# Altium schematic sheet ltk-mw-tx-rx.SchDoc: MW Bench - combined
size A3; Author: Davide Bortolami; DocumentNumber: 1; Revision: 3.0; SheetNumber: 1; SheetTotal: 3
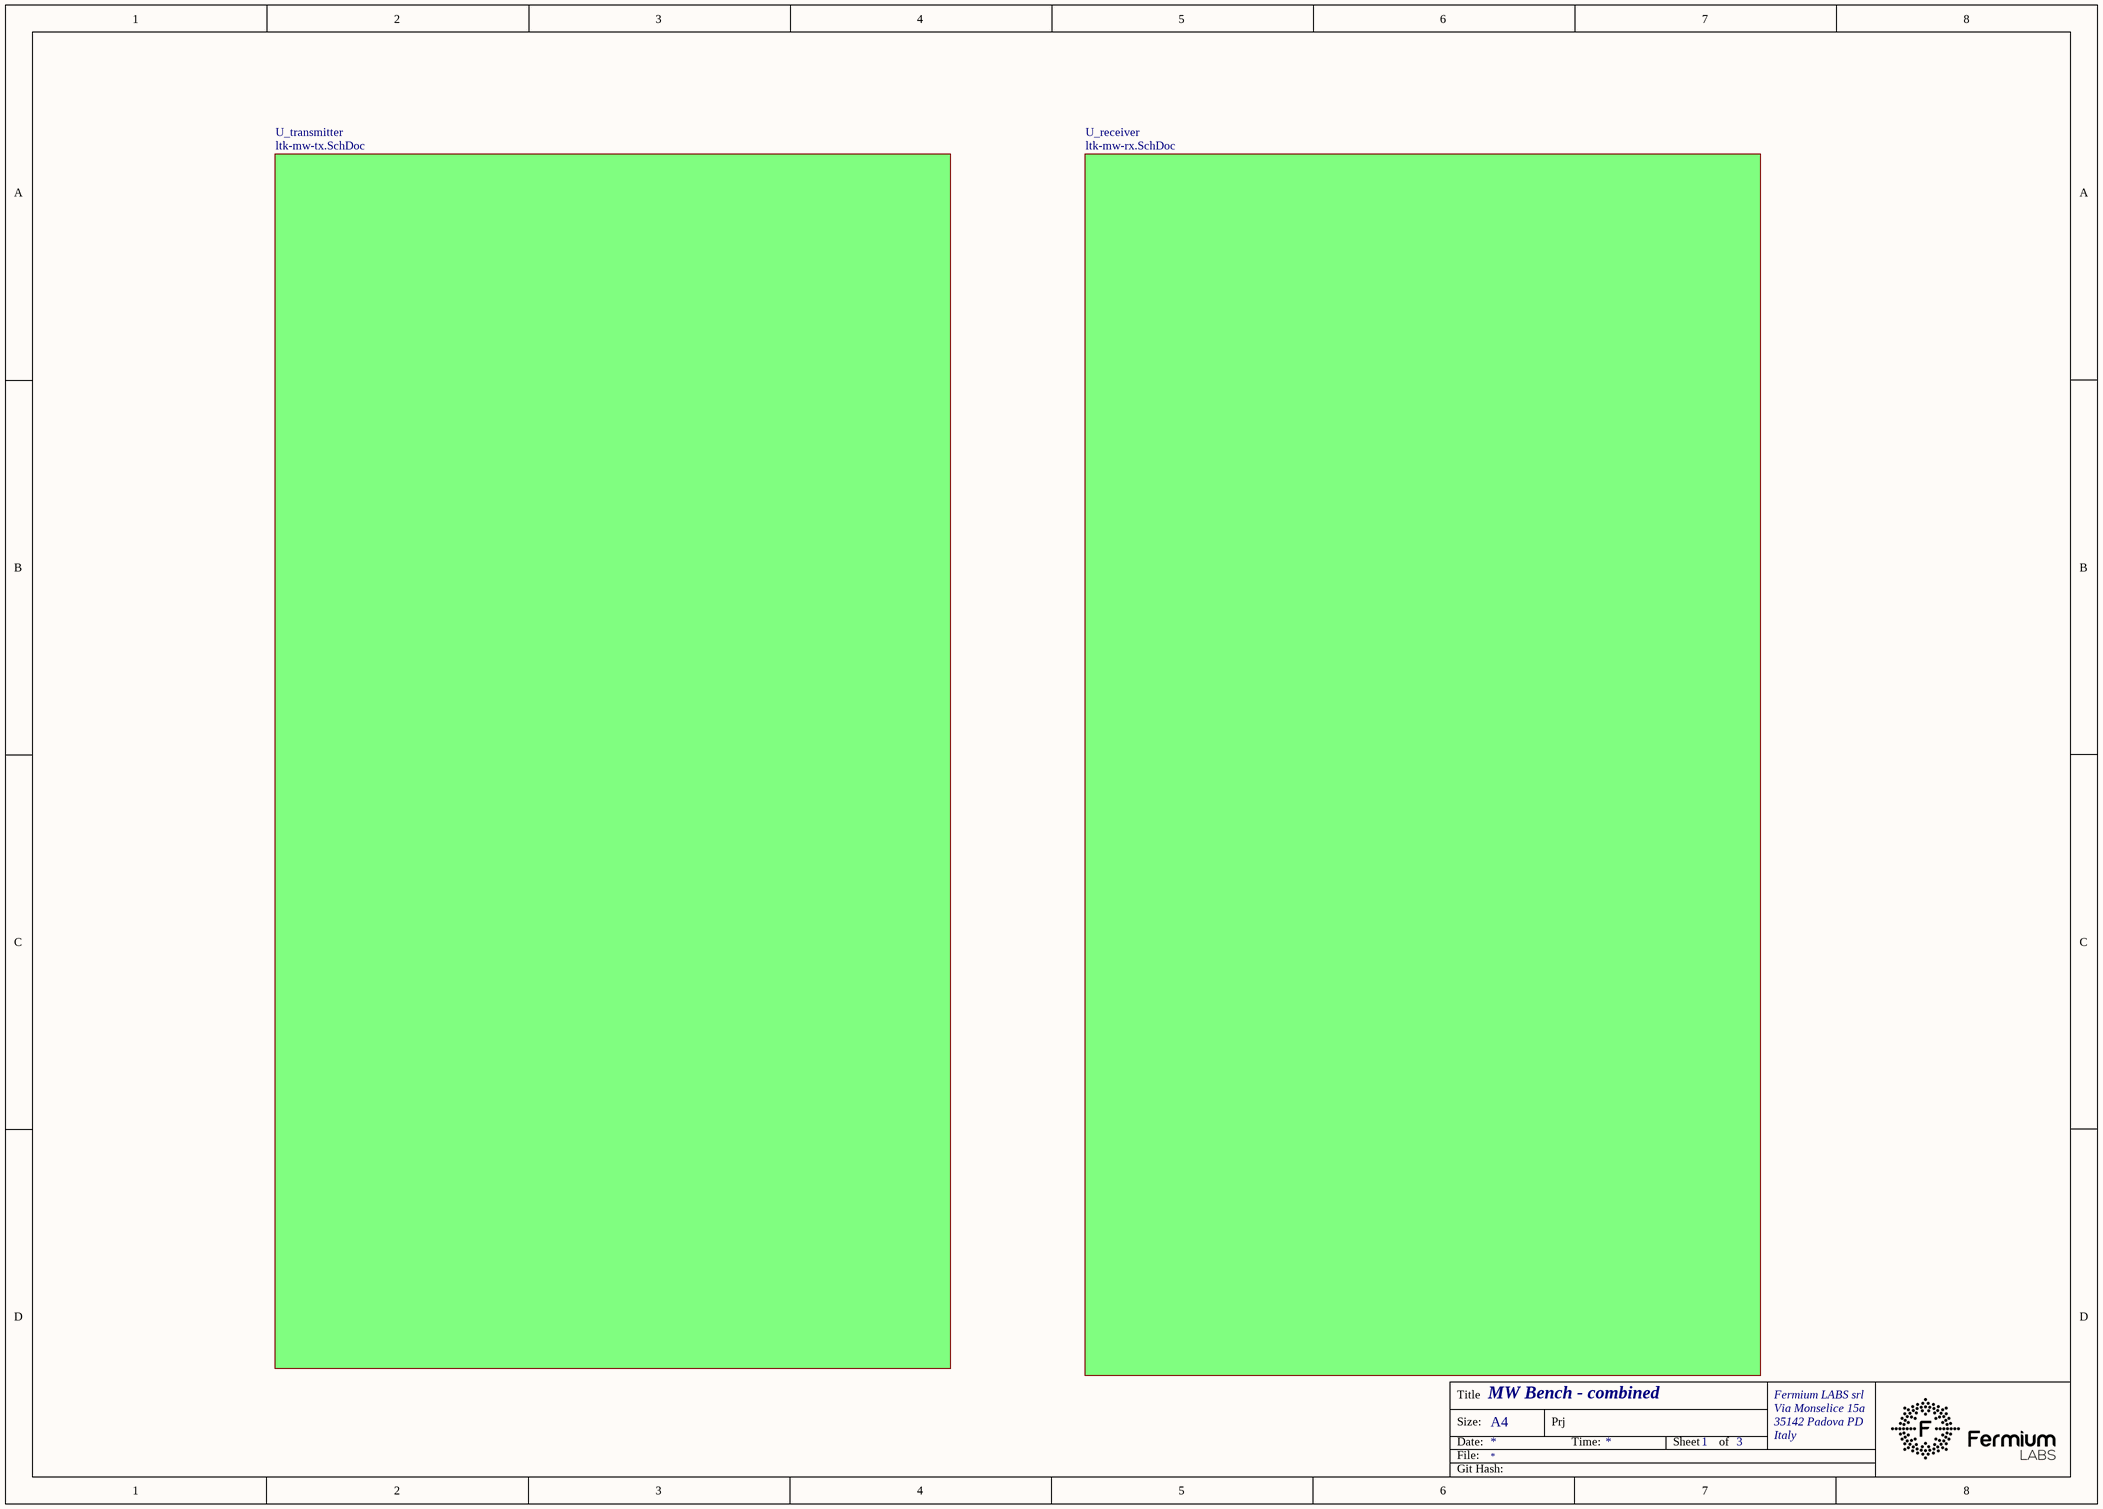
[diagram p0: ltk-mw-tx-rx.SchDoc]

## Sub-sheets
U_receiver = ltk-mw-rx.SchDoc: no entries
U_transmitter = ltk-mw-tx.SchDoc: no entries

## Notes on the sheet
- Title
- Fermium LABS srl
- Size:
- Date:
- File:
- A4
- Prj
- Time:
- Sheet
- of
- Via Monselice 15a
- 35142 Padova PD
- Italy
- Git Hash: